# EAGLE design fotodiodo (EAGLE 7.2.0)
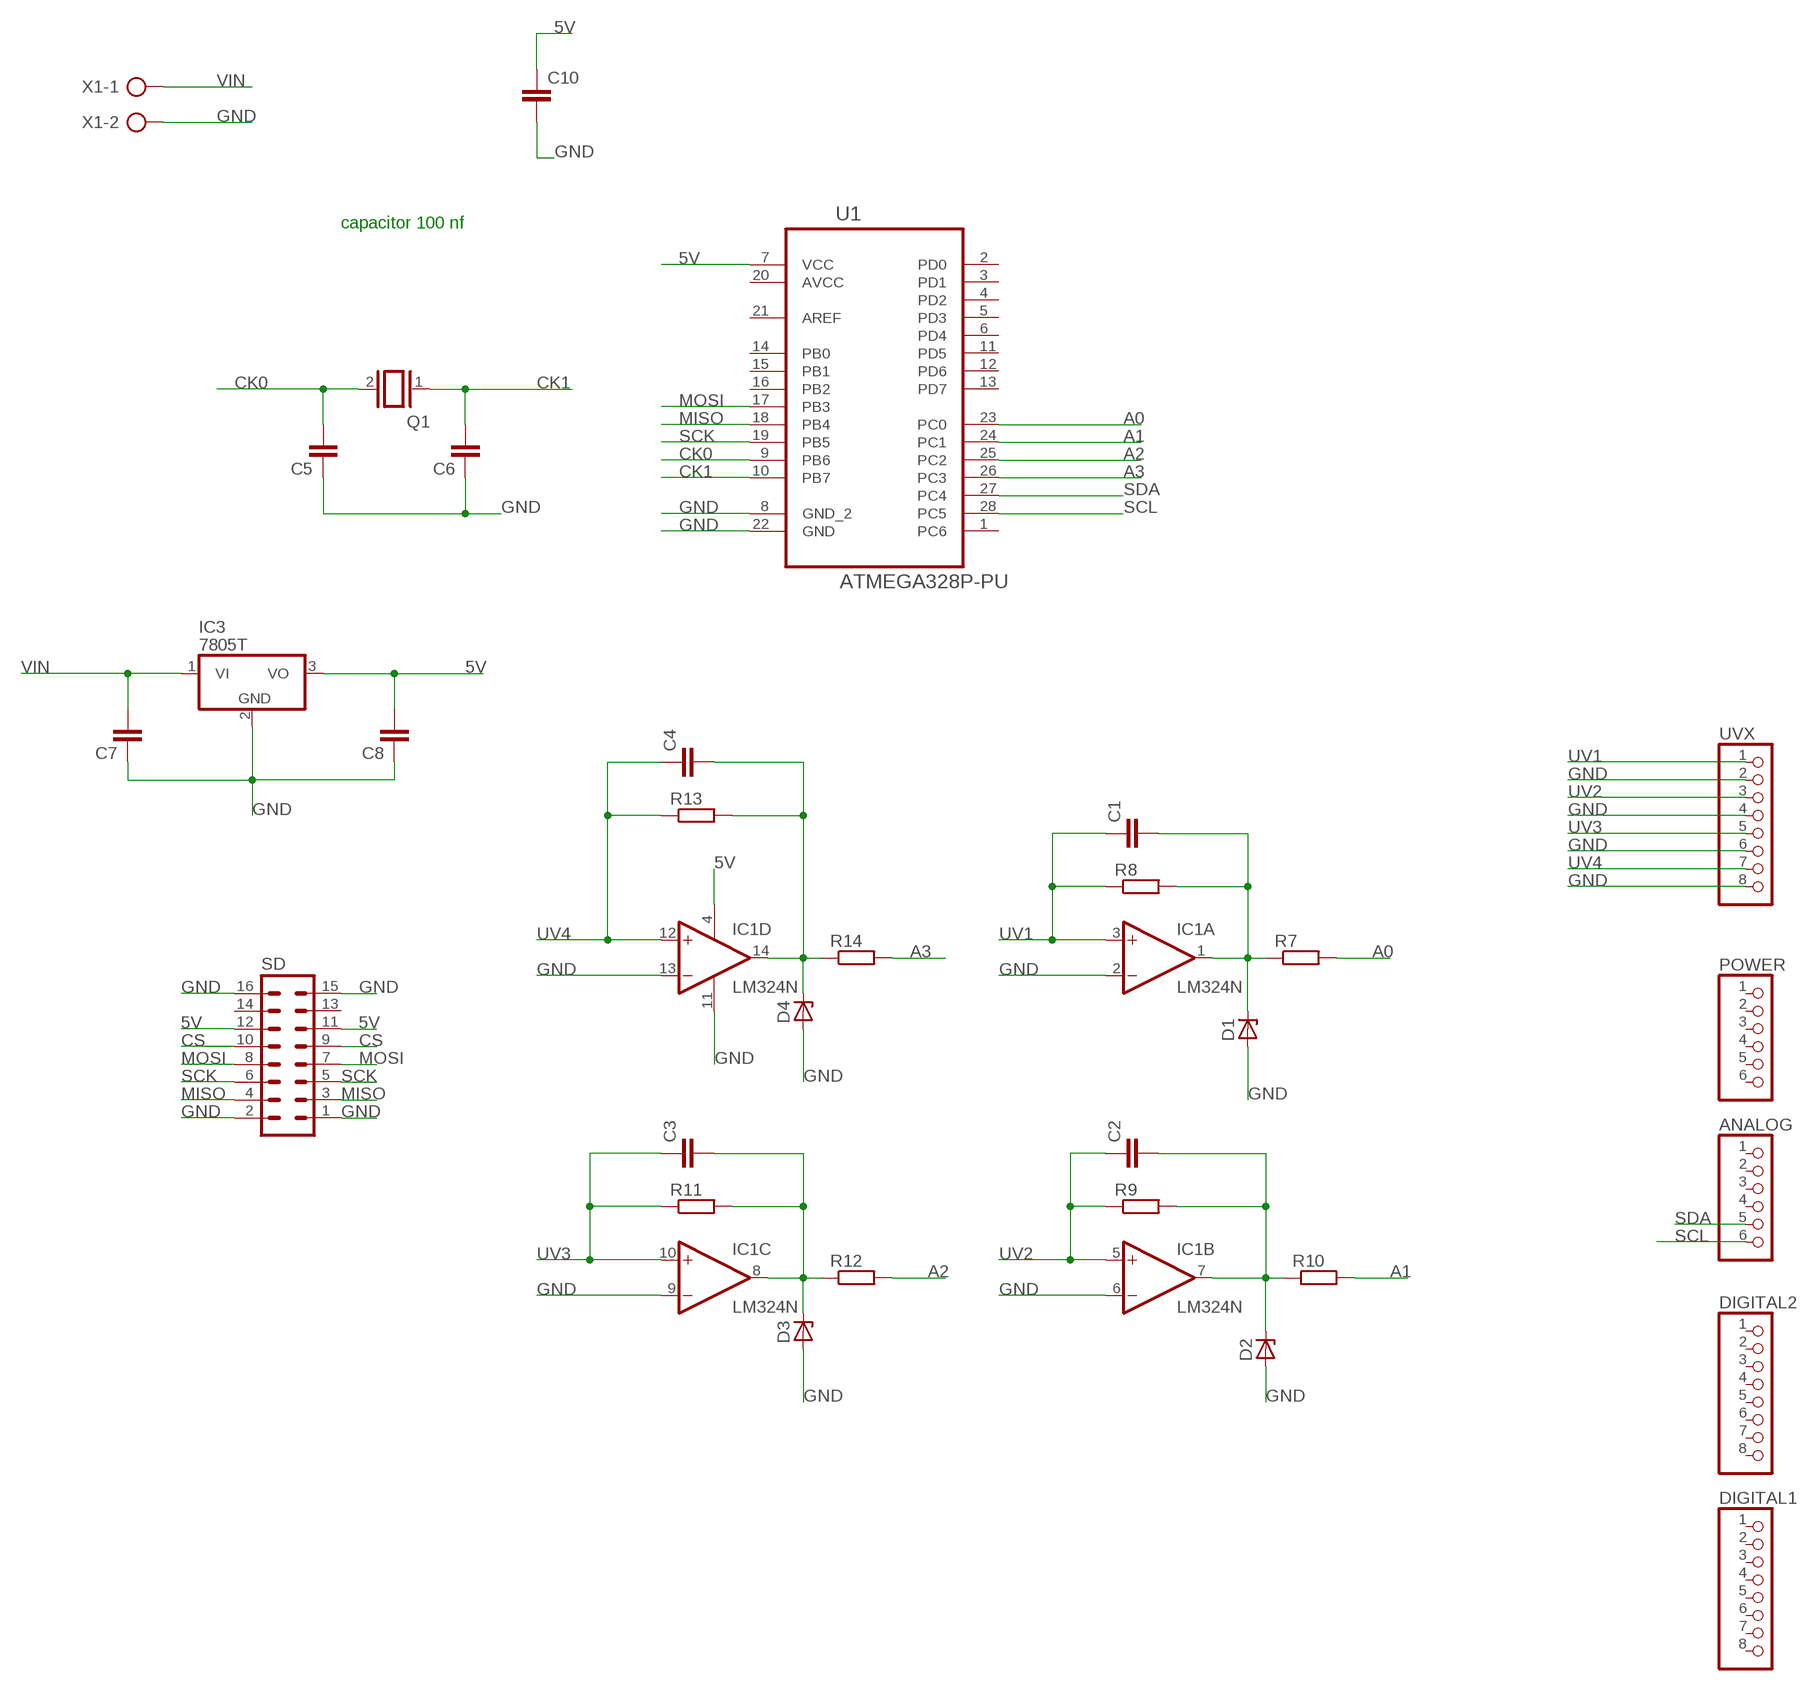
[diagram p0: schematic, sheet 1]

## Parts
ANALOG  PINHD-1X6  [1X06]
C1  C-EU025-025X050  [C025-025X050]
C2  C-EU025-025X050  [C025-025X050]
C3  C-EU025-025X050  [C025-025X050]
C4  C-EU025-025X050  [C025-025X050]
C5  C-EU025-025X050  [C025-025X050]
C6  C-EU025-025X050  [C025-025X050]
C7  C-EU025-025X050  [C025-025X050]
C8  C-EU025-025X050  [C025-025X050]
C10  C-EU050-055X075  [C050-055X075]
D1  ZENER-DIODEC1702-15  [C1702-15]
D2  ZENER-DIODEC1702-15  [C1702-15]
D3  ZENER-DIODEC1702-15  [C1702-15]
D4  ZENER-DIODEC1702-15  [C1702-15]
DIGITAL1  PINHD-1X8  [1X08]
DIGITAL2  PINHD-1X8  [1X08]
IC1  LM324N  [DIL14]
IC3  7805T  [TO220H]
POWER  PINHD-1X6  [1X06]
Q1  XTAL/S  [QS]
R7  R-EU_0207/10  [0207/10]
R8  R-EU_0207/10  [0207/10]
R9  R-EU_0207/10  [0207/10]
R10  R-EU_0207/10  [0207/10]
R11  R-EU_0207/10  [0207/10]
R12  R-EU_0207/10  [0207/10]
R13  R-EU_0207/10  [0207/10]
R14  R-EU_0207/10  [0207/10]
SD  MA08-2  [MA08-2]
U1  ATMEGA328P-PU  [DIP254P762X457-28]
UVX  PINHD-1X8  [1X08]
X1  AK500/2-H  [AK500/2-H]

## Nets
5V: C8.2 C10.1 IC1.4(P:V+) IC3.3(VO) SD.11 SD.12 U1.7(VCC)
A0: R7.2 U1.23(PC0)
A1: R10.2 U1.24(PC1)
A2: R12.2 U1.25(PC2)
A3: R14.2 U1.26(PC3)
CK0: C5.2 Q1.2 U1.9(PB6)
CK1: C6.2 Q1.1 U1.10(PB7)
CS: SD.9 SD.10
GND: C5.1 C6.1 C7.1 C8.1 C10.2 D1.A D2.A D3.A D4.A IC1.2(A:-IN) IC1.6(B:-IN) IC1.9(C:-IN) IC1.11(P:V-) IC1.13(D:-IN) IC3.2(GND) SD.1 SD.2 SD.15 SD.16 U1.8(GND_2) U1.22(GND) UVX.2 UVX.4 UVX.6 UVX.8 X1.2
MISO: SD.3 SD.4 U1.18(PB4)
MOSI: SD.7 SD.8 U1.17(PB3)
N$1: C1.2 D1.C IC1.1(A:OUT) R7.1 R8.2
N$15: C4.2 D4.C IC1.14(D:OUT) R13.2 R14.1
N$20: C3.2 D3.C IC1.8(C:OUT) R11.2 R12.1
N$28: C2.2 D2.C IC1.7(B:OUT) R9.2 R10.1
SCK: SD.5 SD.6 U1.19(PB5)
SCL: ANALOG.6 U1.28(PC5)
SDA: ANALOG.5 U1.27(PC4)
UV1: C1.1 IC1.3(A:+IN) R8.1 UVX.1
UV2: C2.1 IC1.5(B:+IN) R9.1 UVX.3
UV3: C3.1 IC1.10(C:+IN) R11.1 UVX.5
UV4: C4.1 IC1.12(D:+IN) R13.1 UVX.7
VIN: C7.2 IC3.1(VI) X1.1
Unconnected: ANALOG.1 ANALOG.2 ANALOG.3 ANALOG.4 DIGITAL1.1 DIGITAL1.2 DIGITAL1.3 DIGITAL1.4 DIGITAL1.5 DIGITAL1.6 DIGITAL1.7 DIGITAL1.8 DIGITAL2.1 DIGITAL2.2 DIGITAL2.3 DIGITAL2.4 DIGITAL2.5 DIGITAL2.6 DIGITAL2.7 DIGITAL2.8 POWER.1 POWER.2 POWER.3 POWER.4 POWER.5 POWER.6 SD.13 SD.14 U1.1(PC6) U1.2(PD0) U1.3(PD1) U1.4(PD2) U1.5(PD3) U1.6(PD4) U1.11(PD5) U1.12(PD6) U1.13(PD7) U1.14(PB0) U1.15(PB1) U1.16(PB2) U1.21(AREF)

## Notes on the sheet
- capacitor 100 nf

## Power pins joined to a net without a drawn wire
AVCC: U1.20(AVCC)

## Library data of the parts
ANALOG POWER = pinhead:PINHD-1X6: PIN HEADER
C1-C8 = rcl:C-EU: CAPACITOR, European symbol
C10 = resistor:C-EU: CAPACITOR, European symbol
D1-D4 = diode:ZENER-DIODE: Z-Diode
DIGITAL1 DIGITAL2 UVX = pinhead:PINHD-1X8: PIN HEADER
IC1 = linear:LM324: OP AMP
IC3 = linear:78*: Positive VOLTAGE REGULATOR Source: http://cache.national.com/ds/LM/LM78L05.pdf http://www.fairchildsemi.com/ds/LM/LM7805.pdf
Q1 = special:XTAL/S: CRYSTAL
R7-R14 = rcl:R-EU_: RESISTOR, European symbol
SD = con-lstb:MA08-2: PIN HEADER; OC_FARNELL: unknown; OC_NEWARK: unknown
U1 = Atmel_By_element14_Batch_1-00:ATMEGA328P-PU: 8-bit Microcontroller with In-System Programmable Flash; MPN: ATMEGA328P-PU; OC_FARNELL: 1715487; OC_NEWARK: 15R0268; PACKAGE: PDIP-28; SUPPLIER: Atmel
X1 = con-ptr500:AK500/2-H: CONNECTOR Aug. 2004 / PTR Meßtechnik: Die Bezeichnung der Serie AK505 wurde geändert. Es handelt sich hierbei um AK500 in horizontaler Ausführung.; OC_FARNELL: unknown; OC_NEWARK: unknown

## Net classes
0 default: width 0.406 mm

## Board
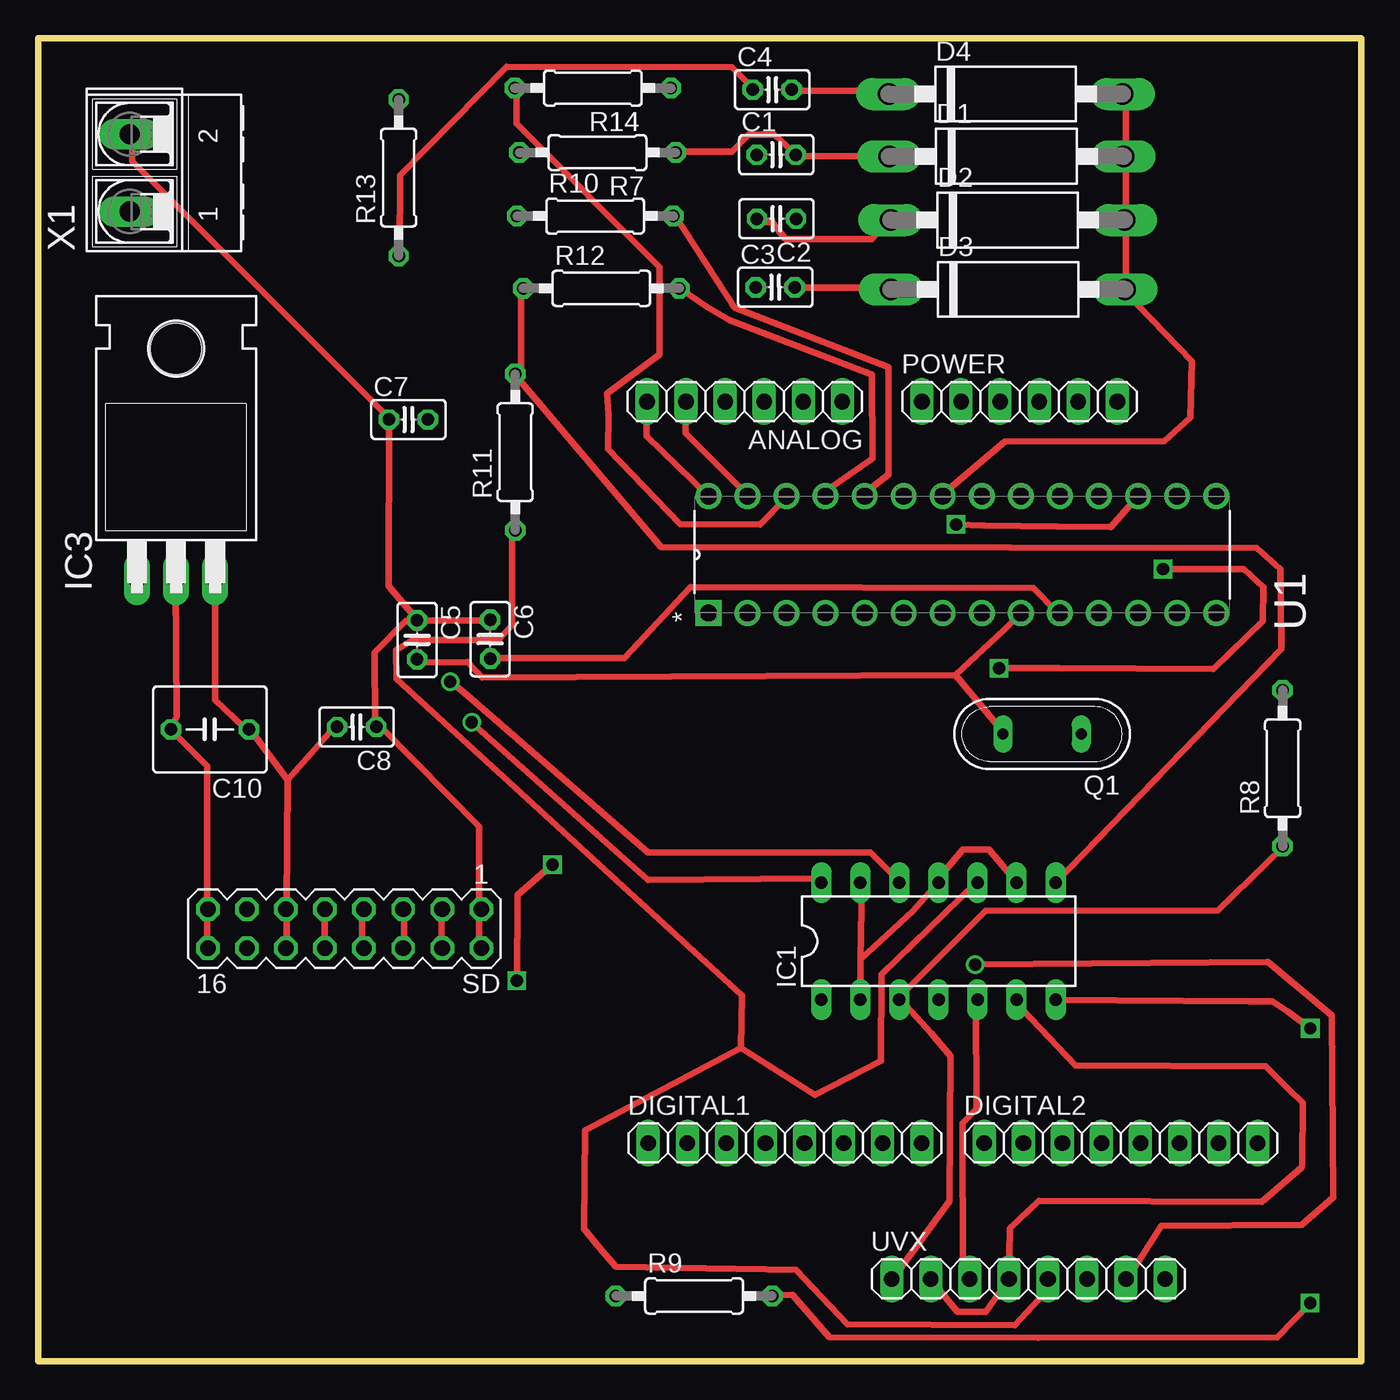
[diagram p1: board, top side]
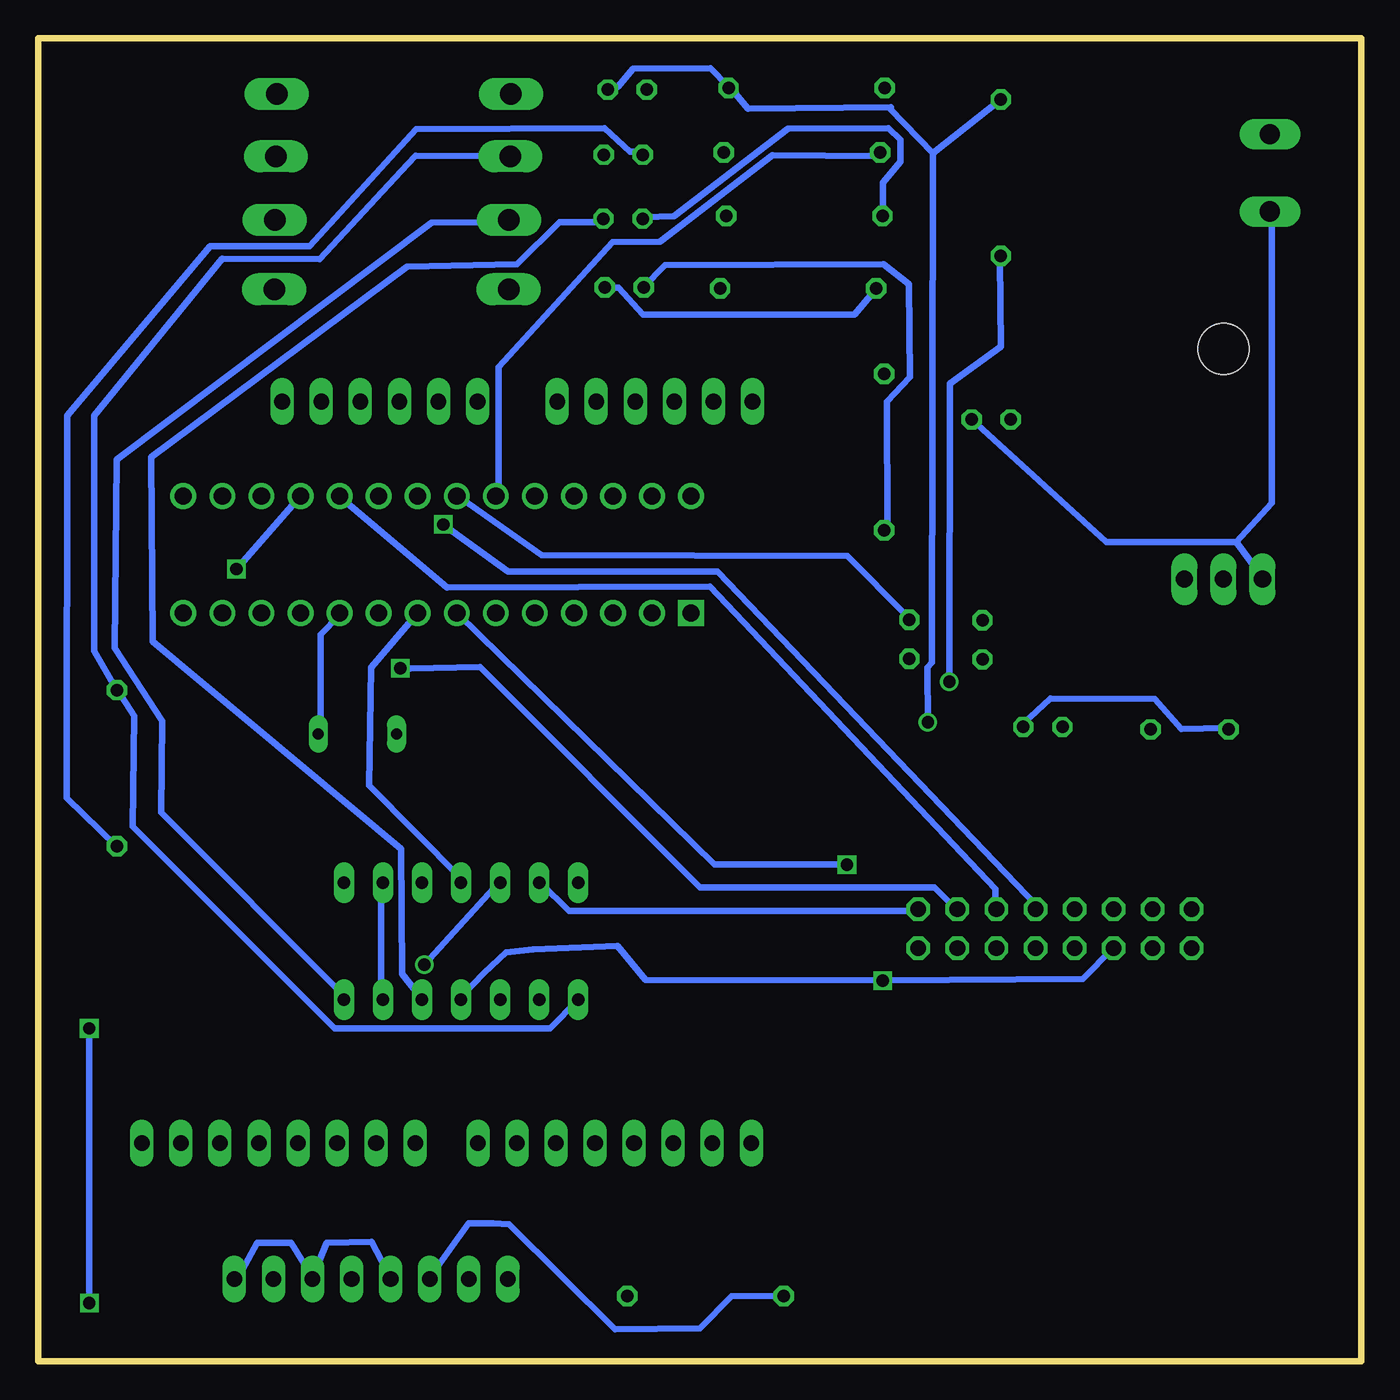
[diagram p2: board, bottom side, seen from below]

Size 86 x 86 mm. Coordinates in mm from the lower left corner, seen from the top.
Outline: 0,0 86,0 86,86 0,86 0,0
Copper layers (1*16): Top 0.035mm / dielectric 1.5mm / Bottom 0.035mm
Design rules "default *": minimum track width 10mil, minimum drill 26mil, track to track 12mil, track to pad 12mil, pad to pad 12mil, via to via 12mil, smd to smd 12mil, copper to edge 40mil, drill to drill 8mil, minimum pad ring 10mil, minimum via ring 8mil, stop-mask expansion 4mil, vias tented up to drill 0mil, thermal gap 10mil

### Footprints (pad centres in the part's own frame; a part is rotated, then mirrored left to right if it is on the bottom)
1X06 = drill 1.016 long: 1 -6.35,0; 2 -3.81,0; 3 -1.27,0; 4 1.27,0; 5 3.81,0; 6 6.35,0
C025-025X050 = drill 0.813 octagon: 1 -1.27,0; 2 1.27,0
C050-055X075 = drill 0.813 octagon: 1 -2.54,0; 2 2.54,0
C1702-15 = drill 1.397 long: A 7.62,0; C -7.62,0
1X08 = drill 1.016 long: 1 -8.89,0; 2 -6.35,0; 3 -3.81,0; 4 -1.27,0; 5 1.27,0; 6 3.81,0; 7 6.35,0; 8 8.89,0
DIL14 = drill 0.813 long: 1 -7.62,-3.81; 2 -5.08,-3.81; 3 -2.54,-3.81; 4 0,-3.81; 5 2.54,-3.81; 6 5.08,-3.81; 7 7.62,-3.81; 8 7.62,3.81; 9 5.08,3.81; 10 2.54,3.81; 11 0,3.81; 12 -2.54,3.81; 13 -5.08,3.81; 14 -7.62,3.81
TO220H = drill 1.118 long: 1 -2.54,-10.16; 2 0,-10.16; 3 2.54,-10.16 | hole 3.302: 0,4.826
QS = drill 0.711 long: 1 -2.54,0; 2 2.54,0
0207/10 = drill 0.813 octagon: 1 -5.08,0; 2 5.08,0
MA08-2 = drill 1.016 octagon: 1 -8.89,-1.27; 2 -8.89,1.27; 3 -6.35,-1.27; 4 -6.35,1.27; 5 -3.81,-1.27; 6 -3.81,1.27; 7 -1.27,-1.27; 8 -1.27,1.27; 9 1.27,-1.27; 10 1.27,1.27; 11 3.81,-1.27; 12 3.81,1.27; 13 6.35,-1.27; 14 6.35,1.27; 15 8.89,-1.27; 16 8.89,1.27
DIP254P762X457-28 = drill 1.118 square: 1 -7.62,33.02 | drill 1.118: 2 -7.62,30.48; 3 -7.62,27.94; 4 -7.62,25.4; 5 -7.62,22.86; 6 -7.62,20.32; 7 -7.62,17.78; 8 -7.62,15.24; 9 -7.62,12.7; 10 -7.62,10.16; 11 -7.62,7.62; 12 -7.62,5.08; 13 -7.62,2.54; 14 -7.62,0; 15 0,0; 16 0,2.54; 17 0,5.08; 18 0,7.62; 19 0,10.16; 20 0,12.7; 21 0,15.24; 22 0,17.78; 23 0,20.32; 24 0,22.86; 25 0,25.4; 26 0,27.94; 27 0,30.48; 28 0,33.02
AK500/2-H = drill 1.321 long: 1 -2.515,0; 2 2.515,0

### Placement (x,y rotation side)
ANALOG  45.92,62.39 180 top
C1  47.98,78.44 0 top
C2  47.99,74.28 180 top
C3  47.91,69.82 0 top
C4  47.71,82.67 0 top
C5  24.62,46.89 270 top
C6  29.37,46.94 270 top
C7  24.06,61.22 0 top
C8  20.69,41.23 180 top
C10  11.15,41.07 180 top
D1  62.94,78.34 0 top
D2  63.02,74.19 0 top
D3  63.05,69.69 0 top
D4  62.89,82.39 0 top
DIGITAL1  48.54,14.18 0 top
DIGITAL2  70.39,14.18 0 top
IC1  58.52,27.3 0 top
IC3  8.95,61 0 top
POWER  63.8,62.39 0 top
Q1  65.26,40.77 180 top
R7  36.35,78.58 180 top
R8  80.9,38.55 90 top
R9  42.63,4.23 0 top
R10  36.2,74.45 0 top
R11  31,59.1 90 top
R12  36.6,69.75 0 top
R13  23.42,76.95 90 top
R14  36.05,82.77 180 top
SD  19.9,28.12 180 top
U1  76.58,56.25 90 top
UVX  64.37,5.34 0 top
X1  5.93,77.26 90 top

### Tracks (layer width: path | path; a pad name or v marks a point on that pad's centre or on a via)
5V  (via drill 0.8)
  Top 0.406: 16.2,37.8 19.2,41.15 C8.2 | 16.2,37.8 13.72,41.15 C10.1 13.41,41.15 11.48,42.98 11.48,50.6 IC3.3 | SD.12 16.15,27.13 16.15,29.26 SD.11 16.15,29.57 16.2,37.8 | v33.43,32.28 31.14,30.3 v31.11,24.74
  Bottom 0.406: IC1.4 58.44,23.77 57.01,25.23 55.59,26.58 53.83,26.76 48.35,26.98 46.54,24.77 v31.11,24.74 18.1,24.85 16.15,26.82 SD.12 | v33.43,32.28 42.04,32.29 58.76,48.61 58.82,48.61 U1.7
A0
  Bottom 0.406: R7.2 31.39,78.33 38.27,78.41 45.57,72.79 48.66,72.76 56.08,64.62 56.08,56.39 U1.23
A1
  Top 0.406: R10.2 41.45,74.37 45.25,68.48 55.28,64.63 55.27,57.63 53.65,56.39 U1.24
A2
  Top 0.406: R12.2 43.44,68.55 44.94,67.68 54.19,64.13 54.24,58.68 50.9,56.39 U1.25
A3
  Top 0.406: R14.2 31.09,82.6 31.09,80.47 40.39,71.12 40.39,65.45 36.98,62.9 37.05,61.5 37.05,59.3 41.73,54.41 46.9,54.4 48.58,56.08 48.66,56.08 U1.26
CK0
  Top 0.406: 59.64,44.6 62.79,47.55 63.7,48.46 U1.9 | 59.64,44.6 62.79,40.84 Q1.2 | 59.64,44.6 28.86,44.45 27.89,45.47 24.69,45.41 C5.2
CK1
  Top 0.406: C6.2 29.57,45.72 38.1,45.72 42.4,50.34 64.69,50.28 66.14,48.77 U1.10
  Bottom 0.406: Q1.1 67.67,40.84 67.67,47.24 66.45,48.46 U1.10
CS
  Top 0.406: SD.10 18.59,27.13 18.59,29.26 SD.9
GND
  Top 0.406: UVX.2 57.97,5.38 59.75,3.19 61.62,3.19 62.95,5.08 UVX.4 63.09,5.18 63.15,8.63 65.05,10.42 79.53,10.36 82.13,12.6 82.18,12.92 82.21,16.8 81.27,17.71 79.82,19.17 67.41,19.23 63.4,23.47 IC1.6 | 53.45,26.12 53.55,31.09 IC1.13 | 53.45,26.12 53.44,23.77 IC1.2 | 53.45,26.12 56.85,29.27 58.49,31.1 IC1.11 58.52,31.39 60.11,33.27 61.79,33.28 63.4,31.39 IC1.9 | D4.A 70.71,82.3 70.71,78.64 D1.A 70.71,78.33 70.71,74.37 D2.A 70.71,74.07 70.71,69.8 D3.A 70.66,69.74 70.64,69.54 74.98,65.01 74.89,61.36 73.2,59.81 62.84,59.8 58.83,56.39 U1.22 | SD.16 10.97,27.13 10.97,29.26 SD.15 10.97,29.57 10.97,38.71 8.84,40.84 C10.2 8.99,41.9 8.94,50.65 IC3.2 | SD.2 28.65,27.13 28.65,29.26 SD.1 28.65,29.57 28.65,34.75 22.35,41.15 C8.1 21.9,41.45 21.85,46.08 23.88,48.11 C5.1 | C6.1 29.26,48.16 24.69,48.16 C5.1 | C5.1 24.38,48.46 22.77,50.38 22.82,61.26 C7.1 22.86,61.27 6.1,78.03 6.1,79.55 X1.2
  Bottom 0.406: UVX.8 73.15,5.18 71.79,7.69 69.57,7.69 68.13,5.38 UVX.6 68.22,5.28 67.26,7.69 64.33,7.75 63.05,5.28 UVX.4 | IC1.6 63.7,23.77 63.7,31.09 IC1.9 | U1.8 64.39,45.09 64.52,37.43 58.52,31.39 IC1.11 | C10.2 8.84,41.15 11.68,41.11 13.42,43.05 20.21,43.07 21.95,41.45 C8.1 | U1.22 58.52,56.08 58.04,55.76 53.28,52.41 33.41,52.36 29.57,48.46 C6.1 | IC1.13 53.34,31.09 51.51,29.26 28.96,29.26 SD.1
MISO  (via drill 0.8)
  Top 0.406: SD.4 26.21,27.13 26.21,29.26 SD.3 | v73.12,51.5 78.39,51.49 79.64,50.33 79.61,48.11 76.39,45 66.37,45.07 v62.47,45.05
  Bottom 0.406: v73.12,51.5 69.06,56.15 U1.18 | v62.47,45.05 61.82,45.03 57.3,45.14 42.98,30.79 27.74,30.79 26.52,29.57 SD.3
MOSI  (via drill 0.8)
  Top 0.406: SD.8 21.03,27.13 21.03,29.26 SD.7 | v59.68,54.39 61.47,54.34 66.25,54.28 69.72,54.24 71.5,56.29 71.42,56.25 U1.17
  Bottom 0.406: v59.68,54.39 55.47,51.35 41.84,51.33 21.03,29.57 SD.7
N$1
  Top 0.406: D1.C 55.17,78.33 49.38,78.33 C1.2 49.07,78.64 47.86,79.75 46.17,79.75 45.11,78.64 41.45,78.64 R7.1
  Bottom 0.406: IC1.1 50.9,23.47 52.73,21.64 66.75,21.64 79.86,34.75 79.76,41.94 80.87,43.65 R8.2 82.37,46.16 82.38,61.48 74.04,71.69 67.73,71.66 61.99,77.83 61.49,78.38 55.47,78.33 D1.C
N$15  (via drill 0.8)
  Top 0.406: C4.2 49.07,82.6 55.17,82.6 D4.C | v28.17,41.54 39.62,31.27 50.6,31.39 IC1.14
  Bottom 0.406: 27.84,78.54 30.62,81.44 30.58,81.54 39.88,81.44 40.84,82.6 R14.1 41.15,82.91 42.31,84.07 47.34,84.02 48.3,82.86 48.77,82.91 C4.2 | 27.84,78.54 23.47,81.99 R13.2 | v28.17,41.54 28.2,45.11 27.89,45.41 27.84,78.54
N$20
  Top 0.406: C3.2 49.38,69.8 55.17,69.8 D3.C | IC1.8 80.81,46.3 80.77,49.74 80.75,51.51 79.24,52.87 63.18,52.9 40.49,52.92 31.09,64.01 R11.2 31.09,64.31 31.39,64.62 31.39,69.49 R12.1
  Bottom 0.406: C3.2 49.07,69.8 48.29,69.79 46.69,68.03 32.95,68.03 31.7,69.49 R12.1
N$28  (via drill 0.8)
  Top 0.406: C2.2 46.94,74.07 47.7,74.07 48.57,72.95 54.2,72.95 55.17,74.07 D2.C | v82.7,3.77 80.55,1.55 65.02,1.52 51.44,1.54 49.03,4.29 47.61,4.29 R9.2 | v82.7,21.63 81.26,22.69 80.24,23.4 78.73,23.4 65.84,23.47 IC1.7
  Bottom 0.406: R10.1 31.09,74.68 31.08,76.61 29.95,78 29.96,79.42 30.73,80.16 37.27,80.12 44.67,74.45 46.63,74.37 C2.2 | v82.7,3.77 82.71,10.21 82.7,12.26 v82.7,21.63 | D2.C 55.47,74.07 60.43,74.03 80.91,58.61 81.05,46.37 77.95,41.63 78.03,35.66 66.14,23.77 IC1.7
SCK
  Top 0.406: SD.6 23.77,27.13 23.77,29.26 SD.5
  Bottom 0.406: U1.19 66.14,56.08 65.95,55.82 59.43,50.29 42.35,50.36 23.77,30.69 23.77,29.57 SD.5
SCL
  Top 0.406: ANALOG.6 39.52,62.28 39.52,60.15 43.53,56.29 U1.28
SDA
  Top 0.406: ANALOG.5 42.12,62.23 42.07,60.35 46.02,56.39 U1.27
UV1
  Top 0.406: UVX.1 55.53,5.33 59.23,10.38 59.31,19.85 58.03,21.34 56.08,23.48 IC1.3 56.08,23.77 61.57,29.26 76.69,29.31 80.92,33.39 R8.1
  Bottom 0.406: C1.1 46.94,78.64 47.54,78.65 49.18,80.15 61.45,80.09 68.36,72.49 74.84,72.49 84.12,61.48 84.18,36.63 80.93,33.45 R8.1
UV2
  Top 0.406: IC1.5 60.96,23.47 60.99,16.39 60.08,15.47 60.1,5.94 60.66,5.18 UVX.3
  Bottom 0.406: R9.1 40.95,4.21 42.99,2.12 48.49,2.08 55.39,8.91 56.43,8.96 58.03,8.94 60.66,5.28 UVX.3 | C2.1 49.38,74.07 52.12,74.07 54.86,71.32 62.01,71.17 78.67,58.78 78.59,46.77 62.42,33.29 62.35,25.16 61.27,23.77 IC1.5
UV3
  Top 0.406: 45.69,20.37 35.54,15 35.48,8.6 36.65,7.17 37.55,6.12 49.27,5.94 52.59,2.38 63.49,2.33 65.84,4.88 UVX.5 | 45.69,20.37 50.49,17.32 54.77,19.52 54.81,25.13 60.96,31.09 IC1.10 | 45.69,20.37 45.76,23.77 23.29,44.36 23.27,46.23 24.33,46.89 29.92,46.89 30.79,47.85 30.79,53.95 R11.1
  Bottom 0.406: R11.1 30.79,54.25 30.84,62.4 29.34,63.98 29.41,70.03 31.05,71.33 45.27,71.27 46.68,69.8 C3.1
UV4  (via drill 0.8)
  Top 0.406: R13.1 23.47,71.93 23.52,77.11 30.43,84.17 45.11,84.12 46.33,82.91 C4.1 | v60.9,25.77 79.92,25.95 84.09,22.48 84.18,10.64 82.14,8.85 73.01,8.78 70.71,5.18 UVX.7 | v26.77,44.17 27.66,43.48 39.62,33.07 54.1,33.07 55.78,31.39 IC1.12
  Bottom 0.406: v60.9,25.77 56.08,31.09 IC1.12 | v26.77,44.17 26.73,63.56 23.42,65.97 23.47,71.63 R13.1
VIN
  Bottom 0.406: 8.12,53.26 16.56,53.27 25.33,61.26 25.2,61.16 C7.2 | 8.12,53.26 6.4,50.9 IC3.1 | 8.12,53.26 5.79,55.78 5.79,74.68 X1.1